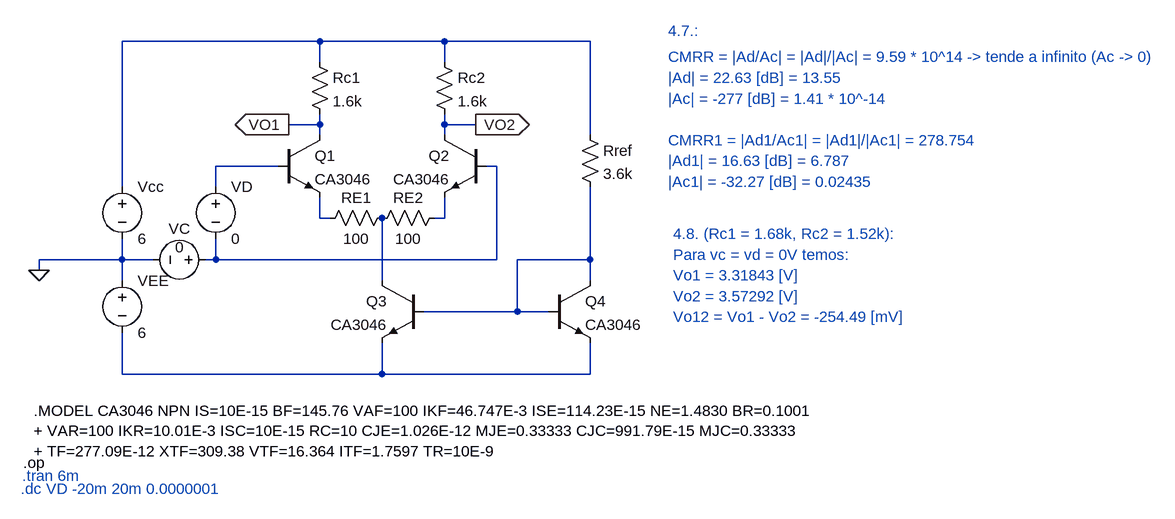
[diagram p0: schematic Par_diferencial.asc]
Par_diferencial.asc, the LTspice schematic file:
Version 4
SHEET 1 1472 680
WIRE 48 -48 -256 -48
WIRE 240 -48 48 -48
WIRE 464 -48 240 -48
WIRE 48 -16 48 -48
WIRE 240 -16 240 -48
WIRE 48 80 48 64
WIRE 48 80 0 80
WIRE 240 80 240 64
WIRE 288 80 240 80
WIRE 48 96 48 80
WIRE 240 96 240 80
WIRE 464 96 464 -48
WIRE -16 144 -112 144
WIRE 320 144 304 144
WIRE -256 176 -256 -48
WIRE -112 176 -112 144
WIRE 48 224 48 192
WIRE 64 224 48 224
WIRE 240 224 240 192
WIRE 240 224 224 224
WIRE -256 288 -256 256
WIRE -256 288 -384 288
WIRE -208 288 -256 288
WIRE -112 288 -112 256
WIRE -112 288 -128 288
WIRE 320 288 320 144
WIRE 320 288 -112 288
WIRE 464 288 464 176
WIRE 464 288 352 288
WIRE -384 304 -384 288
WIRE -256 320 -256 288
WIRE 144 320 144 224
WIRE 464 320 464 288
WIRE 352 368 352 288
WIRE 352 368 208 368
WIRE 400 368 352 368
WIRE -256 464 -256 400
WIRE 144 464 144 416
WIRE 144 464 -256 464
WIRE 464 464 464 416
WIRE 464 464 144 464
FLAG -384 304 0
FLAG 0 80 VO1
IOPIN 0 80 Out
FLAG 288 80 VO2
IOPIN 288 80 Out
SYMBOL res 32 -32 R0
SYMATTR InstName Rc1
SYMATTR Value 1.6k
SYMBOL res 224 -32 R0
SYMATTR InstName Rc2
SYMATTR Value 1.6k
SYMBOL res 160 208 R90
WINDOW 0 0 56 VBottom 2
WINDOW 3 32 56 VTop 2
SYMATTR InstName RE1
SYMATTR Value 100
SYMBOL res 240 208 R90
WINDOW 0 0 56 VBottom 2
WINDOW 3 32 56 VTop 2
SYMATTR InstName RE2
SYMATTR Value 100
SYMBOL voltage -256 160 R0
SYMATTR InstName Vcc
SYMATTR Value 6
SYMBOL voltage -112 160 R0
WINDOW 123 0 0 Left 0
WINDOW 39 0 0 Left 0
SYMATTR InstName VD
SYMATTR Value 0
SYMBOL res 448 80 R0
SYMATTR InstName Rref
SYMATTR Value 3.6k
SYMBOL voltage -256 304 R0
SYMATTR InstName VEE
SYMATTR Value 6
SYMBOL npn -16 96 R0
SYMATTR InstName Q1
SYMATTR Value CA3046
SYMBOL npn 304 96 M0
SYMATTR InstName Q2
SYMATTR Value CA3046
SYMBOL npn 208 320 M0
SYMATTR InstName Q3
SYMATTR Value CA3046
SYMBOL npn 400 320 R0
SYMATTR InstName Q4
SYMATTR Value CA3046
SYMBOL voltage -112 288 R90
WINDOW 0 -32 56 VBottom 2
WINDOW 3 -4 56 VBottom 2
WINDOW 123 0 0 Left 0
WINDOW 39 0 0 Left 0
SYMATTR InstName VC
SYMATTR Value 0
TEXT -392 520 Left 2 !.MODEL CA3046 NPN IS=10E-15 BF=145.76 VAF=100 IKF=46.747E-3 ISE=114.23E-15 NE=1.4830 BR=0.1001 \n+ VAR=100 IKR=10.01E-3 ISC=10E-15 RC=10 CJE=1.026E-12 MJE=0.33333 CJC=991.79E-15 MJC=0.33333 \n+ TF=277.09E-12 XTF=309.38 VTF=16.364 ITF=1.7597 TR=10E-9
TEXT -408 600 Left 2 !.op
TEXT 584 -24 Left 2 ;CMRR = |Ad/Ac| = |Ad|/|Ac| = 9.59 * 10^14 -> tende a infinito (Ac -> 0)
TEXT 584 8 Left 2 ;|Ad| = 22.63 [dB] = 13.55
TEXT 584 40 Left 2 ;|Ac| = -277 [dB] = 1.41 * 10^-14
TEXT 584 104 Left 2 ;CMRR1 = |Ad1/Ac1| = |Ad1|/|Ac1| = 278.754
TEXT 584 136 Left 2 ;|Ad1| = 16.63 [dB] = 6.787
TEXT 584 168 Left 2 ;|Ac1| = -32.27 [dB] = 0.02435
TEXT 584 -64 Left 2 ;4.7.:
TEXT -410 620 Left 2 ;.tran 6m
TEXT 592 248 Left 2 ;4.8. (Rc1 = 1.68k, Rc2 = 1.52k):
TEXT 592 280 Left 2 ;Para vc = vd = 0V temos:
TEXT -412 640 Left 2 ;.dc VD -20m 20m 0.0000001
TEXT 592 312 Left 2 ;Vo1 = 3.31843 [V]
TEXT 592 344 Left 2 ;Vo2 = 3.57292 [V]
TEXT 592 376 Left 2 ;Vo12 = Vo1 - Vo2 = -254.49 [mV]

The netlist it stands for:
* Par_diferencial.asc
Rc1 N001 VO1 1.6k
Rc2 N001 VO2 1.6k
RE1 N007 N004 100
RE2 N005 N007 100
Vcc N001 0 6
VD N002 N003 0
Rref N001 N006 3.6k
VEE 0 N008 6
Q1 VO1 N002 N004 0 CA3046
Q2 VO2 N003 N005 0 CA3046
Q3 N007 N006 N008 0 CA3046
Q4 N006 N006 N008 0 CA3046
VC N003 0 0
.model NPN NPN
.model PNP PNP
.lib standard.bjt
.MODEL CA3046 NPN IS=10E-15 BF=145.76 VAF=100 IKF=46.747E-3 ISE=114.23E-15 NE=1.4830 BR=0.1001
+ VAR=100 IKR=10.01E-3 ISC=10E-15 RC=10 CJE=1.026E-12 MJE=0.33333 CJC=991.79E-15 MJC=0.33333
+ TF=277.09E-12 XTF=309.38 VTF=16.364 ITF=1.7597 TR=10E-9
.op
* CMRR = |Ad/Ac| = |Ad|/|Ac| = 9.59 * 10^14 -> tende a infinito (Ac -> 0)
* |Ad| = 22.63 [dB] = 13.55
* |Ac| = -277 [dB] = 1.41 * 10^-14
* CMRR1 = |Ad1/Ac1| = |Ad1|/|Ac1| = 278.754
* |Ad1| = 16.63 [dB] = 6.787
* |Ac1| = -32.27 [dB] = 0.02435
* 4.7.:
* .tran 6m
* 4.8. (Rc1 = 1.68k, Rc2 = 1.52k):
* Para vc = vd = 0V temos:
* .dc VD -20m 20m 0.0000001
* Vo1 = 3.31843 [V]
* Vo2 = 3.57292 [V]
* Vo12 = Vo1 - Vo2 = -254.49 [mV]
.backanno
.end